# Altium schematic sheet 01_MAIN.SchDoc: =GlobalProjectName
size 594 x 420 mm; CheckedBy: A_D; Author: A_D; SheetNumber: 1; SheetTotal: 3; PageSetup: Record=PageOptions|CenterHorizontal=True|CenterVertical=True|PrintScale=0.70|XCorrection=1.00|YCorrection=1.00|PrintKind=2|BorderSize=5000000|LeftOffset=9000|BottomOffset=10100|Orientation=2|PaperLength=11176|PaperWidth=8636|Scale=100|PaperSource=259|PrintQuality=-3|MediaType=1|DitherType=10|PrintScaleMode=1|PaperKind=A3|PaperIndex=8
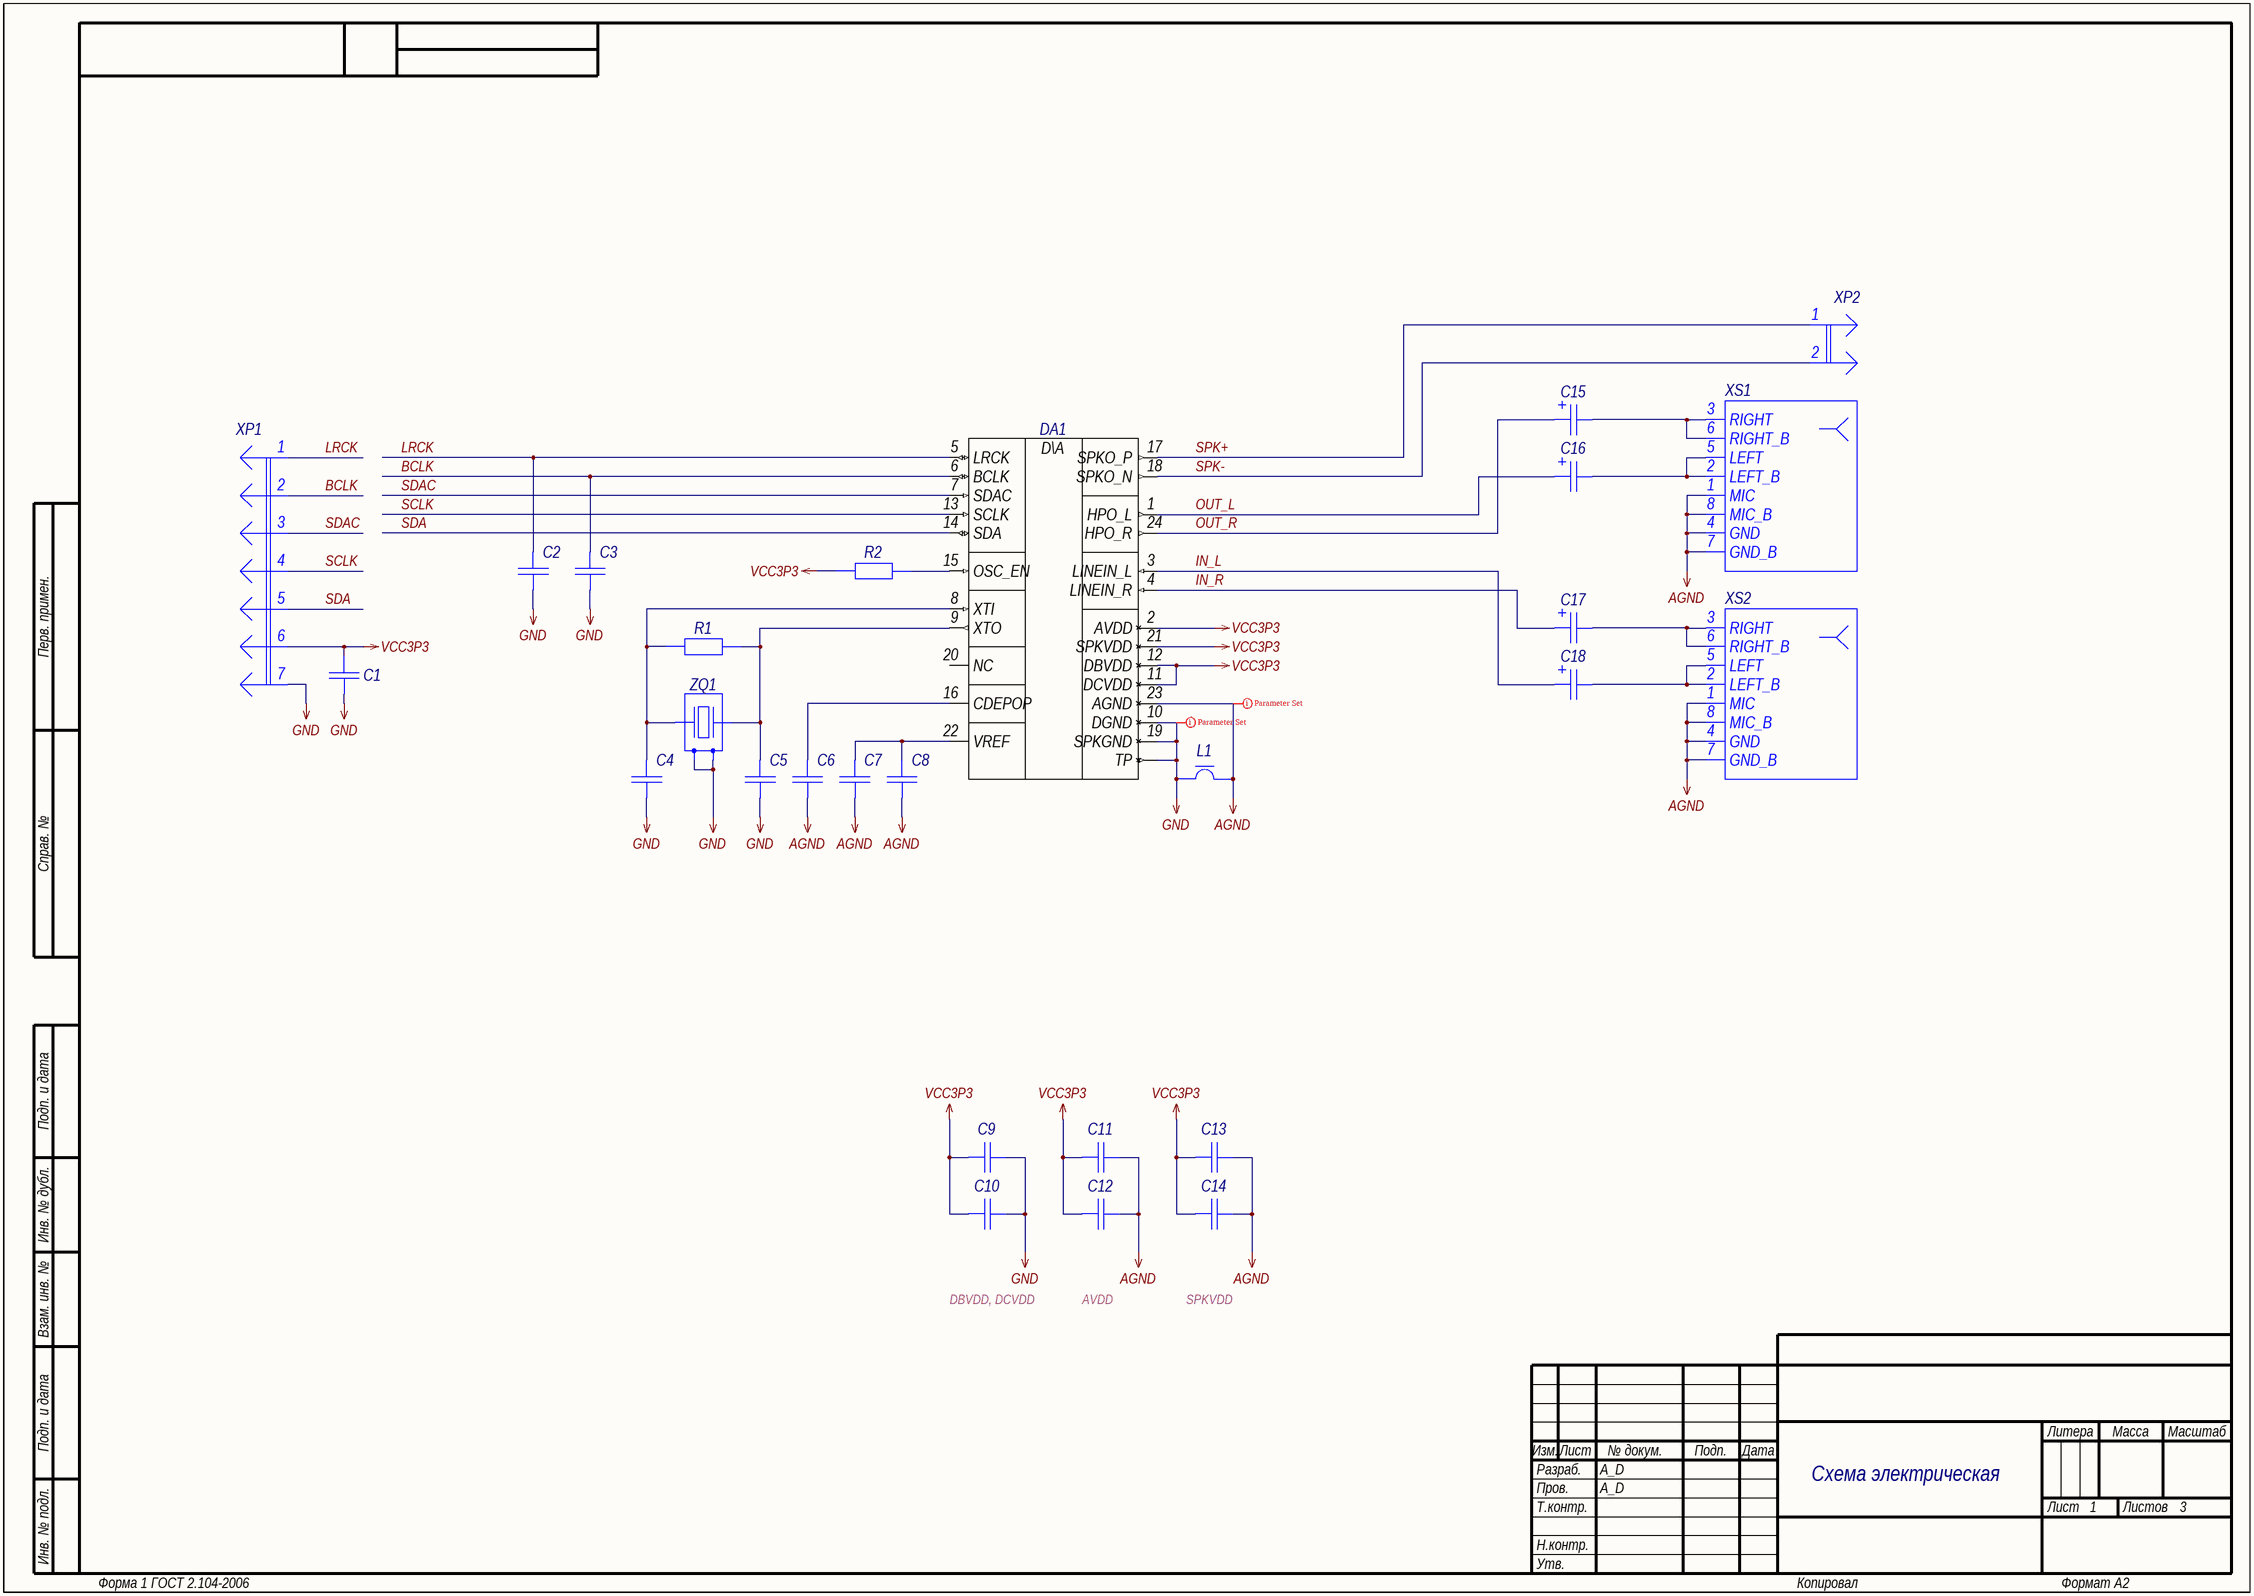
[diagram p0: 01_MAIN.SchDoc]

## Parts
C1  Capacitor  [C0805_L]  (value not drawn)
C2  Capacitor  [C0603_L]  (value not drawn)
C3  Capacitor  [C0603_L]  (value not drawn)
C4  Capacitor  [C0603_L]  (value not drawn)
C5  Capacitor  [C0603_L]  (value not drawn)
C6  Capacitor  [C0603_L]  (value not drawn)
C7  Capacitor  [C0603_L]  (value not drawn)
C8  Capacitor  [C0603_L]  (value not drawn)
C9  Capacitor  [C0603_L]  (value not drawn)
C10  Capacitor  [C0603_L]  (value not drawn)
C11  Capacitor  [C0603_L]  (value not drawn)
C12  Capacitor  [C0603_L]  (value not drawn)
C13  Capacitor  [C0603_L]  (value not drawn)
C14  Capacitor  [C0603_L]  (value not drawn)
C15  Capacitor-T  [C3528-p]  (value not drawn)
C16  Capacitor-T  [C3528-p]  (value not drawn)
C17  Capacitor-T  [C3216-p]  (value not drawn)
C18  Capacitor-T  [C3216-p]  (value not drawn)
DA1  ALC5628  [QFN-24_050P400X400X090_N]  (value not drawn)
L1  FerriteBead  [L0603_L]  (value not drawn)
R1  Resistor  [R0603_L]  (value not drawn)
R2  Resistor  [R0603_L]  (value not drawn)
XP1  Text  [PLS-7]  (value not drawn)
XP2  SPK  [PLS-2]  (value not drawn)
XS1  OUT  [PJ30930-Series]  (value not drawn)
XS2  IN  [PJ30930-Series]  (value not drawn)
ZQ1  Crystal-1_3p_S  [SMD 3.2x2.5mm]  (value not drawn)

## Nets
AGND: C6.1 C7.1 C8.1 C11.2 C12.2 C13.2 C14.2 DA1.23(AGND) L1.2 XS1.1(MIC) XS1.4(GND) XS1.7(GND_B) XS1.8(MIC_B) XS2.1(MIC) XS2.4(GND) XS2.7(GND_B) XS2.8(MIC_B)
GND: C1.1 C2.1 C3.1 C4.1 C5.1 C9.2 C10.2 DA1.10(DGND) DA1.19(SPKGND) DA1.TP L1.1 XP1.7 ZQ1.2 ZQ1.4
VCC3P3: C1.2 C9.1 C10.1 C11.1 C12.1 C13.1 C14.1 DA1.2(AVDD) DA1.11(DCVDD) DA1.12(DBVDD) DA1.21(SPKVDD) R2.1 XP1.6
BCLK: C3.2 DA1.6(BCLK) XP1.2
IN_L: C18.1 DA1.3(LINEIN_L)
IN_R: C17.1 DA1.4(LINEIN_R)
LRCK: C2.2 DA1.5(LRCK) XP1.1
OUT_L: C16.1 DA1.1(HPO_L)
OUT_R: C15.1 DA1.24(HPO_R)
SCLK: DA1.13(SCLK) XP1.4
SDA: DA1.14(SDA) XP1.5
SDAC: DA1.7(SDAC) XP1.3
SPK+: DA1.17(SPKO_P) XP2.1
SPK-: DA1.18(SPKO_N) XP2.2
NetC4_2: C4.2 DA1.8(XTI) R1.1 ZQ1.1
NetC5_2: C5.2 DA1.9(XTO) R1.2 ZQ1.3
NetC6_2: C6.2 DA1.16(CDEPOP)
NetC7_2: C7.2 C8.2 DA1.22(VREF)
NetC15_2: C15.2 XS1.3(RIGHT) XS1.6(RIGHT_B)
NetC16_2: C16.2 XS1.2(LEFT_B) XS1.5(LEFT)
NetC17_2: C17.2 XS2.3(RIGHT) XS2.6(RIGHT_B)
NetC18_2: C18.2 XS2.2(LEFT_B) XS2.5(LEFT)
NetDA1_15: DA1.15(OSC_EN) R2.2

Not connected (* = marked no-connect by the designer): DA1 20(NC)

## Layout directives
rule Polygon Connect Style [Style - Direct Connect]: AGND, GND

## Notes on the sheet
- DBVDD, DCVDD
- AVDD
- SPKVDD
- Схема электрическая
  принципиальная
- Перв. примен.
- Справ. №
- Подп. и дата
- Инв. № дубл.
- Взам. инв. №
- Разраб.
- Изм.
- Лист
- № докум.
- Подп.
- Дата
- Литера
- Масса
- Масштаб
- Пров.
- Т.контр.
- Листов
- Инв. № подл.
- Н.контр.
- Утв.
- Форма 1 ГОСТ 2.104-2006
- Копировал
- Формат А2
- (in symbol ALC5628-GR) D\A

## Library data of the parts
C1 = GRM21BR60J226ME39L: Manufacturer: Murata; Type: Конденсатор; ID: 140; Value: 22uF; Voltage: 6.3V; Tolerance: ±20%; Dielectric Type: X5R; Application Category: 1; Working Temperature Min: -55°С; Working Temperature Max: +85°С; Published: 18.05.2010; Publisher: Andrew Danich; Part Number: GRM21BR60J226ME39L; Footprint: 0805
C2 C3 = GRM1885C1H220JA01D: Manufacturer: Murata; Type: Конденсатор; ID: 122; Value: 22pF; Voltage: 50V; Tolerance: ±5%; Dielectric Type: NP0; Application Category: 1; Working Temperature Min: -55°С; Working Temperature Max: +125°С; Published: 18.05.2010; Publisher: Andrew Danich; Part Number: GRM1885C1H220JA01D; Footprint: 0603
C4 C5 = GCM1885C2A120JA16D: Manufacturer: Murata; Type: Конденсатор; ID: 121; Value: 12pF; Voltage: 100V; Tolerance: ±5%; Dielectric Type: NP0; Application Category: 1; Working Temperature Min: -55°С; Working Temperature Max: +125°С; Published: 18.05.2010; Publisher: Andrew Danich; Part Number: GCM1885C2A120JA16D; Footprint: 0603
C6 C9 C11 = GCM188R71E105KA64D: Manufacturer: Murata; Type: Конденсатор; ID: 134; Value: 1uF; Voltage: 25V; Tolerance: ±10%; Dielectric Type: X7R; Application Category: 1; Working Temperature Min: -55°С; Working Temperature Max: +85°С; Published: 18.05.2010; Publisher: Andrew Danich; Part Number: GCM188R71E105KA64D; Footprint: 0603
C7 = GRM188R72A104KA35D: Manufacturer: Murata; Type: Конденсатор; ID: 232; Value: 0.1uF; Voltage: 100V; Tolerance: ±10%; Dielectric Type: X7R; Application Category: 1; Working Temperature Min: -55°С; Working Temperature Max: +125°С; Published: 18.05.2010; Publisher: Andrew Danich; Part Number: GRM188R72A104KA35D; Footprint: 0603
C8 = GRT188C81E475KE13D: Manufacturer: Murata; Type: Конденсатор; ID: 175; Value: 4.7uF; Voltage: 25V; Tolerance: ±20%; Dielectric Type: X6S; Application Category: 1; Working Temperature Min: -55°С; Working Temperature Max: +105°С; Published: 18.05.2010; Publisher: Andrew Danich; Part Number: GRT188C81E475KE13D; Footprint: 0603
C10 C12 C14 = GRM1885C2A102JA01D: Manufacturer: Murata; Type: Конденсатор; ID: 135; Value: 1000pF; Voltage: 100V; Tolerance: ±5%; Dielectric Type: NP0; Application Category: 1; Working Temperature Min: -55°С; Working Temperature Max: +125°С; Published: 18.05.2010; Publisher: Andrew Danich; Part Number: GRM1885C2A102JA01D; Footprint: 0603
C13 = GRM188C80J106MA73D: Manufacturer: Murata; Type: Конденсатор; ID: 248; Value: 10uF; Voltage: 6.3V; Tolerance: ±20%; Dielectric Type: X6S; Application Category: 1; Working Temperature Min: -55°С; Working Temperature Max: +105°С; Functional Analog: ZRB18AC81A106KE01L; Published: 18.05.2010; Publisher: Andrew Danich; Part Number: GRM188C80J106MA73D; Footprint: 0603
C15 C16 = T520B107M006ATE040: Manufacturer: Kemet; Type: Конденсатор; ID: 26; Value: 100uF; Voltage: 6.3V; Tolerance: ±20%; ESR: 40mohm; Leakage Current: 63uA; Application Category: 1; Working Temperature Min: -55°С; Working Temperature Max: +125°С; Published: 23.04.2010; Publisher: Andrew Danich; Part Number: T520B107M006ATE040; Footprint: B
C17 C18 = 293D105X9016A2TE3: Manufacturer: Vishay Intertechnology; Type: Конденсатор; ID: 4; Value: 1uF; Voltage: 16V; Tolerance: ±10%; ESR: 9.3ohm; Application Category: 1; Published: 23.04.2010; Publisher: Andrew Danich; Part Number: 293D105X9016A2TE3; Footprint: A
DA1 = ALC5628-GR: Manufacturer: Realtek; ID: 8; Supply Operation: +2.3…3.6V; Channel: 2; THD: -86dB; Interface: I2S/PCM; Application Category: 1; Working Temperature Min: -20°С; Working Temperature Max: +85°С; Functional Analog: ALC5628-GRT; Type: Микросхема; Published: 06.09.2018; Publisher: Andrew Danich; Part Number: ALC5628-GR; Value: ALC5628-GR
L1 = BLM18PG121SN1: Manufacturer: Murata; Type: Дроссель; ID: 4; Rated Current: 2A; Impedance at 100Mhz: 120ohm; DC Resistance: 0.05ohm; Inductor Type: EMIFIL; Application Category: 1; Working Temperature Min: -55°С; Working Temperature Max: +125°С; Published: 14.11.2014; Publisher: Andrew Danich; Part Number: BLM18PG121SN1; Value: BLM18PG121SN1; Footprint: 0603
R1 = RC0603JR-071ML: Manufacturer: Yageo; ID: 20; Value: 1meg; Limit Voltage: 50V; Tolerance: ±5%; Temperature Coefficient: 100ppm; Total Power Dissipation: 0.1W; Series Type: Thick-Film; Application Category: 1; Working Temperature Min: -55°С; Working Temperature Max: +155°С; Published: 24.03.2010; Publisher: Andrew Danich; Type: Резистор; Part Number: RC0603JR-071ML; Footprint: 0603
R2 = RC0603JR-070R: Manufacturer: Yageo; ID: 5; Value: 0; Limit Voltage: 50V; Tolerance: ±5%; Temperature Coefficient: 100ppm; Total Power Dissipation: 0.1W; Series Type: Thick-Film; Application Category: 1; Working Temperature Min: -55°С; Working Temperature Max: +155°С; Functional Analog: RC0603FR-070RL, CR0603-J/-000E; Published: 24.03.2010; Publisher: Andrew Danich; Type: Резистор; Part Number: RC0603JR-070R; Footprint: 0603
XP1 = PLS-7: Value: PLS-7; ID: 6; Limit Voltage: 250V; Limit Current: 3A; Connector Type: Male; Resistance: 15momh; Surface Finish: Gold; Pitch: 2.54mm; Application Category: 1; Published: 07.03.2013; Publisher: Andrew Danich; Type: Вилка; Part Number: PLS-7; Pins: 7
XP2 = PLS-2: Value: PLS-2; ID: 1; Limit Voltage: 250V; Limit Current: 3A; Connector Type: Male; Resistance: 15momh; Surface Finish: Gold; Pitch: 2.54mm; Published: 07.03.2013; Publisher: Andrew Danich; Type: Вилка; Part Number: PLS-2; Pins: 2; Application Category: 1
XS1 XS2 = PJ30930-Q-LC0AG00TR-7260: Manufacturer: Dongnan Electronics; ID: 11; Limit Voltage: 30V; Limit Current: 0.5A; Connector Type: Female; Standart: 3.5 mm; Application Category: 1; Working Temperature Min: -25°С; Working Temperature Max: +85°С; Functional Analog: PJ30930-Q-LC0AG00-7260; Value: PJ30930-Q-LC0AG00TR-7260; Published: 06.09.2018; Publisher: Andrew Danich; Type: Розетка; Part Number: PJ30930-Q-LC0AG00TR-7260; Pins: 8; Mount Type: Surface
ZQ1 = MCSJK-7U-24.576-12-30-60-B-30: Manufacturer: Multicomp; ID: 27; Output Frequency: 24.576МГц; Load Capacitance: 12pF; Temperature Coefficient: ±30ppm; Application Category: 1; Working Temperature Min: -20°С; Working Temperature Max: +70°С; Published: 06.09.2018; Publisher: Andrew Danich; Type: Резонатор; Part Number: MCSJK-7U-24.576-12-30-60-B-30; Value: MCSJK-7U-24.576-12-30-60-B-30; Functional Analog: -